# EAGLE schematic FootPrint (EAGLE 7.6.0)
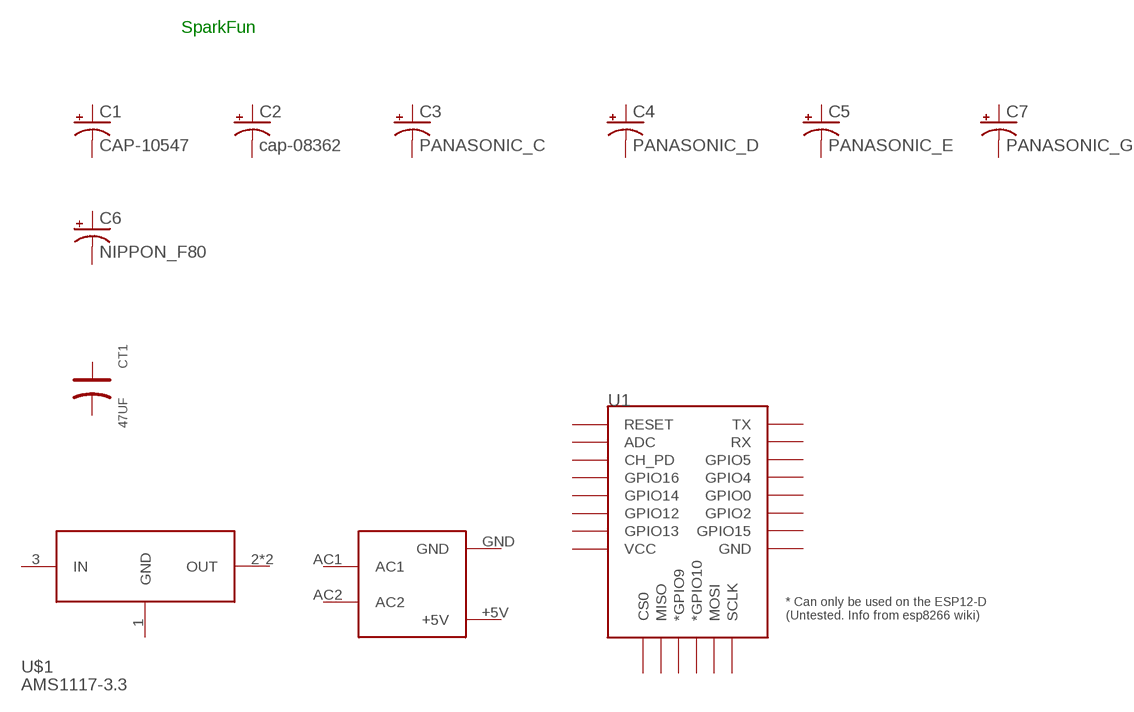
[diagram p0: schematic, sheet 1]

## Parts
C1  CAP-10547  47UF-50V-20%(ELECT)  [PANASONIC_D]
C2  cap-08362  100UF-63V-20%(ELECT)  [NIC_10X10.5_CAP]
C3  PANASONIC_C  CAP_POLC  [PANASONIC_C]
C4  PANASONIC_D  CAP_POLD  [PANASONIC_D]
C5  PANASONIC_E  CAP_POLE  [PANASONIC_E]
C6  NIPPON_F80  CAP_POLF80  [NIPPON_F80]
C7  PANASONIC_G  CAP_POLG  [PANASONIC_G]
CT1  47UF  ALUMINUM-SMD-47UF-25V(D6.3-H5.3MM)  [ELECTRO-SMD-C-6MM]
U1  ESP12ESMD  [ESP12E-SMD]
U$1  AMS1117-3.3  [SOT-223]
U$2  HLK-PM01  [HLK-PM01]
Unconnected: C1.+ C1.- C2.+ C2.- C3.+ C3.- C4.+ C4.- C5.+ C5.- C6.+ C6.- C7.+ C7.- CT1.+ CT1.- U1.ADC U1.CH_PD U1.CS0 U1.GND U1.GPIO0 U1.GPIO2 U1.GPIO4 U1.GPIO5 U1.GPIO9(*GPIO9) U1.GPIO10(*GPIO10) U1.GPIO12 U1.GPIO13 U1.GPIO14 U1.GPIO15 U1.GPIO16 U1.MISO U1.MOSI U1.RESET U1.RXD0(RX) U1.SCLK U1.TXD0(TX) U1.VCC U$1.1(GND) U$1.2(OUT) U$1.3(IN) U$1.4(OUT) U$2.+5V U$2.AC1 U$2.AC2 U$2.GND

## Notes on the sheet
- SparkFun

## Library data of the parts
C1 = SparkFun-Capacitors:47UF-50V-20%(ELECT): CAP-10547; PROD_ID: CAP-10547
C2 = SparkFun-Capacitors:100UF-63V-20%(ELECT): CAP-08362 100uF electrolytic SMT 63V 20%; PROD_ID: CAP-08362; VALUE: 100uF
C3-C7 = SparkFun-Capacitors:CAP_POL: Capacitor Polarized These are standard SMD and PTH capacitors. Normally 10uF, 47uF, and 100uF in electrolytic and tantalum varieties. Always verify the external diameter of the through hole cap, it varies with capacity, voltage, and manufacturer. The EIA devices should be standard.
CT1 = Seeed-OPL-Capacitor:ALUMINUM-SMD-47UF-25V(D6.3-H5.3MM): 302030059; MPN: CS1E470M-CRE54
U1 = esp8266modules:ESP12E: ESP12E Module
U$1 = AMS1117-3.3:AMS1117-3.3: 1A LOW DROPOUT VOLTAGE REGULATOR
U$2 = HLK-PM01:HLK-PM01